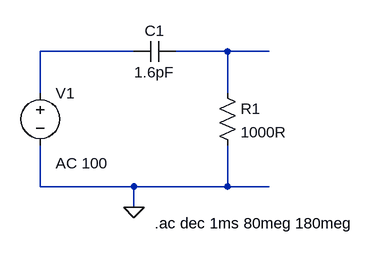
[diagram p0: schematic atividade4-2.asc]
atividade4-2.asc, the LTspice schematic file:
Version 4
SHEET 1 880 680
WIRE 272 80 128 80
WIRE 416 80 336 80
WIRE 480 80 416 80
WIRE 128 144 128 80
WIRE 416 144 416 80
WIRE 128 288 128 224
WIRE 272 288 128 288
WIRE 416 288 416 224
WIRE 416 288 272 288
WIRE 480 288 416 288
WIRE 272 320 272 288
FLAG 272 320 0
SYMBOL voltage 128 128 R0
WINDOW 123 24 124 Left 2
WINDOW 39 0 0 Left 0
SYMATTR Value2 AC 100
SYMATTR InstName V1
SYMATTR Value ""
SYMBOL cap 336 64 R90
WINDOW 0 0 32 VBottom 2
WINDOW 3 32 32 VTop 2
SYMATTR InstName C1
SYMATTR Value 1.6pF
SYMBOL res 400 128 R0
SYMATTR InstName R1
SYMATTR Value 1000R
TEXT 304 344 Left 2 !.ac dec 1ms 80meg 180meg

The netlist it stands for:
* atividade4-2.asc
V1 N001 0 AC 100
C1 N002 N001 1.6pF
R1 N002 0 1000R
.ac dec 1ms 80meg 180meg
.backanno
.end